# Altium project Motherboard.PrjPcb
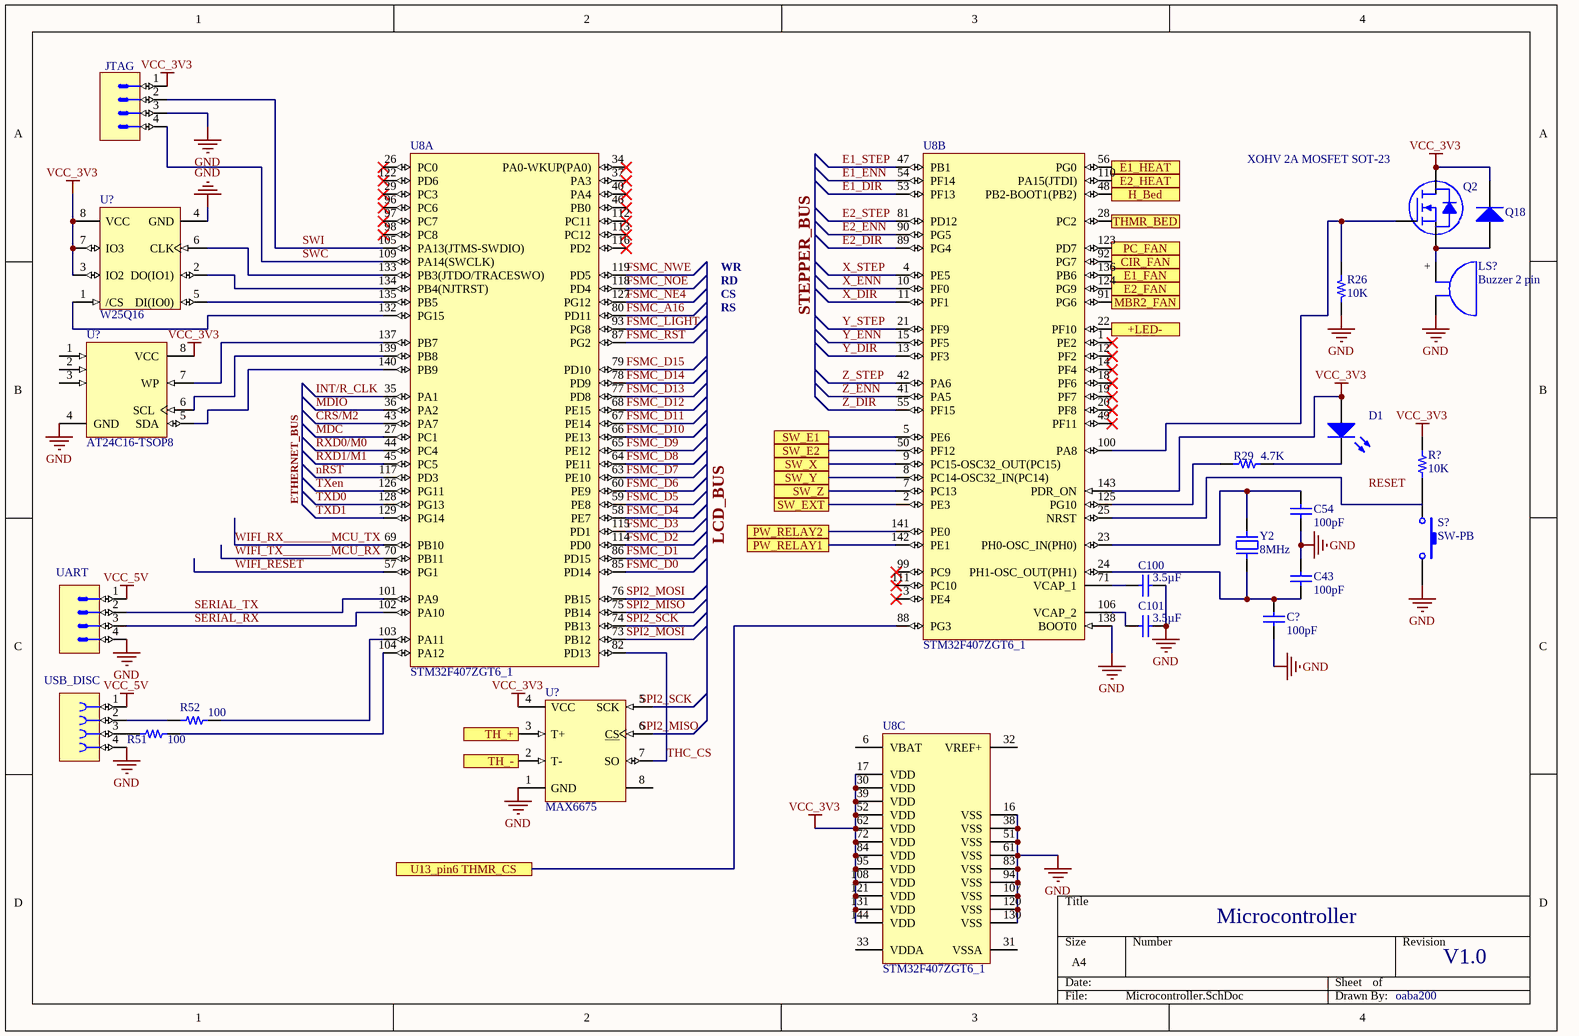
[diagram p0: Microcontroller.SchDoc]
9 sheets, 151 parts. Net scope: flat (ports and power ports of the same name join across sheets).
Sheets:
  Microcontroller.SchDoc
  Stepper drivers.SchDoc
  Heated bed.SchDoc
  LCD Screen.SchDoc
  Limit switches.SchDoc
  Relay controll extension board v1.5.SchDoc
  Extruder.SchDoc
  Ethernet.SchDoc
  Outputs.SchDoc

## Sheet Microcontroller.SchDoc: Microcontroller
size A4; DrawnBy: oaba200; Revision: V1.0

### Parts
(Parts that share a designator on the sheet are numbered #1, #2 ... from top to bottom, then left to right.)
C43  value 100pF  [C1206]  (hidden comment: Cap Semi)
C54  value 100pF  [C1206]  (hidden comment: Cap Semi)
C100  value 3.5µF  [C1206]  (hidden comment: Cap Semi)
C101  value 3.5µF  [C1206]  (hidden comment: Cap Semi)
C?#1  value 100pF  [C1206]  (hidden comment: Cap Semi)
D1  LED3  [3.5X2.8X1.9]  (value not drawn)
JTAG  (no value)
LS?  Buzzer 2 pin
Q2  XOHV 2A MOSFET SOT-23
Q18  Diode 1N4148  [DO-35]  (value not drawn)
R26  10K  [RES 0805_2012]
R29  4.7K  [RES 0805_2012]
R51  100  [RES 0805_2012]
R52  100  [RES 0805_2012]
R?#1  10K  [RES 0805_2012]
S?#1  SW-PB  [SPST-2]
U8  STM32F407ZGT6_1  [STM-LQFP144_N]  (parts A,B,C of 3)
U?#1  W25Q16  [SOIC8]
U?#2  AT24C16-TSOP8  [8A2_N]
U?#3  MAX6675  [SOIC8]
UART  (no value)
USB_DISC  (no value)
Y2  8MHz

### Ports
+LED-, CIR_FAN, E1_FAN, E1_HEAT, E2_FAN, E2_HEAT, H_Bed, MBR2_FAN, PC_FAN, PW_RELAY1, PW_RELAY2, SW_E1, SW_E2, SW_EXT, SW_X, SW_Y, SW_Z, TH_+, TH_-, THMR_BED, U13_pin6 THMR_CS

### Nets
GND: C43.1 C54.2 C100.2 C101.2 C?#1.2 JTAG.3 LS?.- R26.1 S?#1.2 U8.16(VSS) U8.38(VSS) U8.51(VSS) U8.61(VSS) U8.83(VSS) U8.94(VSS) U8.107(VSS) U8.120(VSS) U8.130(VSS) U8.138(BOOT0) U?#1.4(GND) U?#2.4(GND) U?#3.1(GND) UART.4 USB_DISC.4
VCC_3V3: D1.1(A) JTAG.1 Q2.3(D) Q18.2(K) R?#1.2 U8.17(VDD) U8.30(VDD) U8.39(VDD) U8.52(VDD) U8.62(VDD) U8.72(VDD) U8.84(VDD) U8.95(VDD) U8.108(VDD) U8.121(VDD) U8.131(VDD) U8.143(PDR_ON) U8.144(VDD) U?#1.3(IO2) U?#1.7(IO3) U?#1.8(VCC) U?#2.8(VCC) U?#3.4(VCC)
VCC_5V: UART.1 USB_DISC.1
CRS/M2: U8.43(PA7)
E1_DIR: U8.53(PF13)
E1_ENN: U8.54(PF14)
E1_STEP: U8.47(PB1)
E2_DIR: U8.89(PG4)
E2_ENN: U8.90(PG5)
E2_STEP: U8.81(PD12)
FSMC_A16: U8.80(PD11)
FSMC_D0: U8.85(PD14)
FSMC_D1: U8.86(PD15)
FSMC_D2: U8.114(PD0)
FSMC_D3: U8.115(PD1)
FSMC_D4: U8.58(PE7)
FSMC_D5: U8.59(PE8)
FSMC_D6: U8.60(PE9)
FSMC_D7: U8.63(PE10)
FSMC_D8: U8.64(PE11)
FSMC_D9: U8.65(PE12)
FSMC_D10: U8.66(PE13)
FSMC_D11: U8.67(PE14)
FSMC_D12: U8.68(PE15)
FSMC_D13: U8.77(PD8)
FSMC_D14: U8.78(PD9)
FSMC_D15: U8.79(PD10)
FSMC_LIGHT: U8.93(PG8)
FSMC_NE4: U8.127(PG12)
FSMC_NOE: U8.118(PD4)
FSMC_NWE: U8.119(PD5)
FSMC_RST: U8.87(PG2)
INT/R_CLK: U8.35(PA1)
MDC: U8.27(PC1)
MDIO: U8.36(PA2)
nRST: U8.117(PD3)
RXD0/M0: U8.44(PC4)
RXD1/M1: U8.45(PC5)
SERIAL_RX: U8.102(PA10) UART.3
SERIAL_TX: U8.101(PA9) UART.2
SPI2_MISO: U8.75(PB14)
SPI2_MOSI: U8.73(PB12) U8.76(PB15)
SPI2_SCK: U8.74(PB13)
SWC: JTAG.4 U8.109(PA14(SWCLK))
SWI: JTAG.2 U8.105(PA13(JTMS-SWDIO))
THC_CS: U8.82(PD13) U?#3.7(SO)
Thermocouple_+: U?#3.3(T+) ; port TH_+
Thermocouple_-: U?#3.2(T-) ; port TH_-
TXD0: U8.128(PG13)
TXD1: U8.129(PG14)
TXen: U8.126(PG11)
WIFI_RESET: U8.57(PG1)
WIFI_RX________MCU_TX: U8.69(PB10)
WIFI_TX________MCU_RX: U8.70(PB11)
X_DIR: U8.11(PF1)
X_ENN: U8.10(PF0)
X_STEP: U8.4(PE5)
Y_DIR: U8.13(PF3)
Y_ENN: U8.15(PF5)
Y_STEP: U8.21(PF9)
Z_DIR: U8.55(PF15)
Z_ENN: U8.41(PA5)
Z_STEP: U8.42(PA6)
NetC43_2: C43.2 C?#1.1 U8.24(PH1-OSC_OUT(PH1)) Y2.1
NetC54_1: C54.1 U8.23(PH0-OSC_IN(PH0)) Y2.2
NetC100_1: C100.1 U8.71(VCAP_1)
NetC101_1: C101.1 U8.106(VCAP_2)
NetD1_2: D1.2(K) R29.1
NetJP35_1: U8.141(PE0) ; port PW_RELAY2
NetLS?_+: LS?.+ Q2.2(S) Q18.1(A)
NetQ2_1: Q2.1(G) R26.2 U8.100(PA8)
NetQ?_1: U8.110(PA15(JTDI)) ; port E2_HEAT
NetR2_1: U8.5(PE6) ; port SW_E1
NetR3#3_2: U8.22(PF10) ; port +LED-
NetR4_2: U8.50(PF12) ; port SW_E2
NetR6#2_1: U8.9(PC15-OSC32_OUT(PC15)) ; port SW_X
NetR8_2: U8.8(PC14-OSC32_IN(PC14)) ; port SW_Y
NetR10_1: U8.7(PC13) ; port SW_Z
NetR16_1: U8.142(PE1) ; port PW_RELAY1
NetR27_2: U8.91(PG6) ; port MBR2_FAN
NetR29_2: R29.2 U8.125(PG10)
NetR31#2_2: U8.124(PG9) ; port E2_FAN
NetR34_1: U8.136(PB6) ; port E1_FAN
NetR39_1: U8.48(PB2-BOOT1(PB2)) ; port H_Bed
NetR43_1: U8.28(PC2) ; port THMR_BED
NetR48_2: U8.123(PD7) ; port PC_FAN
NetR51_1: R51.1 USB_DISC.3
NetR51_2: R51.2 U8.104(PA12)
NetR52_1: R52.1 USB_DISC.2
NetR52_2: R52.2 U8.103(PA11)
NetR?#1_1: R?#1.1 S?#1.1
NetR?#6_1: U8.2(PE3) ; port SW_EXT
NetU8_56: U8.56(PG0) ; port E1_HEAT
NetU8_88: U8.88(PG3) ; port U13_pin6 THMR_CS
NetU8_92: U8.92(PG7) ; port CIR_FAN
NetU8_132: U8.132(PG15) U?#1.1(/CS)
NetU8_133: U8.133(PB3(JTDO/TRACESWO)) U?#1.6(CLK)
NetU8_134: U8.134(PB4(NJTRST)) U?#1.2(DO(IO1))
NetU8_135: U8.135(PB5) U?#1.5(DI(IO0))
NetU8_137: U8.137(PB7) U?#2.7(WP)
NetU8_139: U8.139(PB8) U?#2.6(SCL)
NetU8_140: U8.140(PB9) U?#2.5(SDA)

Not connected (* = marked no-connect by the designer): U8 1(PE2)* 3(PE4)* 6(VBAT) 12(PF2)* 14(PF4)* 18(PF6)* 19(PF7)* 20(PF8)* 25(NRST) 26(PC0)* 29(PC3)* 31(VSSA) 32(VREF+) 33(VDDA) 34(PA0-WKUP(PA0))* 37(PA3)* 40(PA4)* 46(PB0)* 49(PF11)* 96(PC6)* 97(PC7)* 98(PC8)* 99(PC9)* 111(PC10)* 112(PC11)* 113(PC12)* 116(PD2)* 122(PD6)*; U?#2 1 2 3; U?#3 5(SCK) 6(CS) 8

### Buses and harness runs
bus ETHERNET_BUS
bus LCD_BUS
bus STEPPER_BUS

### Notes on the sheet
- WR
- RD
- CS
- RS
- Labels drawn without touching a wire or pin: RESET, SPI2_MISO, SPI2_SCK

### Library data of the parts
C43 C54 C100 C101 C?#1 = Cap Semi: Capacitor (Semiconductor SIM Model); Published: 8-Jun-2000; LatestRevisionDate: 29-May-2009; LatestRevisionNote: IPC-7351 Footprint Added.; PackageReference: C1206; Publisher: Altium Limited; PackageDescription: Chip Capacitor
D1 = LED3: Typical BLUE SiC LED; Published: 8-Jun-2000; LatestRevisionDate: 17-Dec-2003; LatestRevisionNote: PCB Footprint replaced.; DatasheetVersion: 16-Apr-2002; PackageVersion: 16-Apr-2002; PackageReference: 3.5X2.8X1.9; Publisher: Altium Limited; PackageDescription: SM LED; 2 C-Bend Leads; Body 3.5 x 2.8 x 1.9 mm, inc leads (LxWxH typ)
JTAG UART = Connector 4 Male
Q18 = Diode 1N4148: High Conductance Fast Diode; Published: 8-Jun-2000; LatestRevisionDate: 17-Jul-2002; LatestRevisionNote: Re-released for DXP Platform.; DatasheetVersion: 1997; PackageReference: DO-35; Publisher: Altium Limited; PackageDescription: Diode, Axial; Body 3.8 x 1.9 mm (LxDia. max), Lead Dia. 0.53 mm (max); Code_JEDEC: DO-204-AH; ComponentLink1Description: Manufacturer Link; ComponentLink1URL: http://www.fairchildsemi.com/; ComponentLink2Description: Datasheet; ComponentLink2URL: http://www.fairchildsemi.com/ds/1N%2F1N4148.pdf
R26 R29 R51 R52 R?#1 = Resistor: SMT Resistor
  R26: VALUE: 10K
  R29: VALUE: 4.7K
  R51 R52: VALUE: 100
  R?#1: Value: 10K
S?#1 = SW-PB: Switch; Published: 24-Mar-1999; LatestRevisionDate: 17-Jul-2002; LatestRevisionNote: Re-released for DXP Platform.; PackageReference: SPST-2; Publisher: Altium Limited; PackageDescription: Switch; 2 Leads
U8 = STM32F407ZGT6_1: V2 ARM Cortex-M4 32-bit MCU+FPU, 210 DMIPS, 1024 kB Flash, 192 kB Internal RAM, 114 I/Os, 144-pin LQFP, -40 to 85 degC, Tray; Manufacturer: STMicroelectronics; D/A Converter: 2x12-bit; FLASH Size (Prog) (kB): 1024; I/Os (High Current): 114; Internal RAM Size (kB): 192; Operating Frequency(F) (Processor speed) (MHz): 168; Supply Voltage(Vcc) max (V): 3.6; Supply Voltage(Vcc) min (V): 1.8; DatasheetVersion: Rev. 4; PackageVersion: Rev. 4, 06/2013; PackageReference: LQFP144; PackageDescription: 144-Pin Low Profile Quad Flat Package, 20 x 20 mm Body, 0.5 mm Pitch; Supplier 1: Digi-Key; Supplier Part Number 1: 497-11766-ND; Supplier 2: Newark; Supplier Part Number 2: 73T2334; Supplier 3: Mouser; Supplier Part Number 3: 511-STM32F407ZGT6; Core: ARM Cortex-M4; Packing: Tray; Mounting Technology: Surface Mount; PartNumber: STM32F407ZGT6; ComponentLink1Description: Manufacturer URL; ComponentLink1URL: http://www.st.com/web/en/home.html; ComponentLink2Description: Datasheet; ComponentLink2URL: http://www.st.com/st-web-ui/static/active/en/resource/technical/document/datasheet/DM00037051.pdf; ComponentLink3Description: Package Specification; ComponentLink3URL: http://www.st.com/st-web-ui/static/active/en/resource/technical/document/datasheet/DM00037051.pdf
U?#1 = W25Q16: FLASH - NOR Memory IC 16Mb _2M x 8_ SPI 104MHz 8-SOIC; MP: W25Q16BVSSIG; MF: Winbond; Availability: Unavailable; SnapEDA_Link: https://www.snapeda.com/parts/W25Q16BVSSIG/Winbond%20Electronics/view-part/512685/?ref=snap; Value: *; Price: None; Package: SOIC-8 Winbond
U?#2 = AT24C16-TSOP8: 1Kbit (128 x 8), 2-wire Bus Automotive Serial EEPROM with Write Protect, 2.5V, 8-Pin TSSOP, Bulk; Published: 20-Sep-2010; DatasheetVersion: 8517C,  Jan-2009; PackageVersion: revD, Dec-2009; PackageReference: 8A2; Publisher: Altium Limited; PackageDescription: 8-Lead, 4.4 mm Body, Plastic Thin Shrink Small Outline Package (TSSOP); Code_JEDEC: MO-153-AA; ComponentLink1Description: Manufacturer Link; ComponentLink1URL: http://www.atmel.com/products/serial/default.asp; ComponentLink2Description: Datasheet; ComponentLink2URL: http://www.atmel.com/dyn/resources/prod_documents/doc8517.pdf; ComponentLink3Description: Atmel.com Home; ComponentLink3URL: http://www.atmel.com
USB_DISC = Connector 4 Female
Y2 = Abracon Crystal ABS06: SMT Crystal; VALUE: 8MHz

## Sheet Stepper drivers.SchDoc: Stepper Drivers
size A4; DrawnBy: oaba200
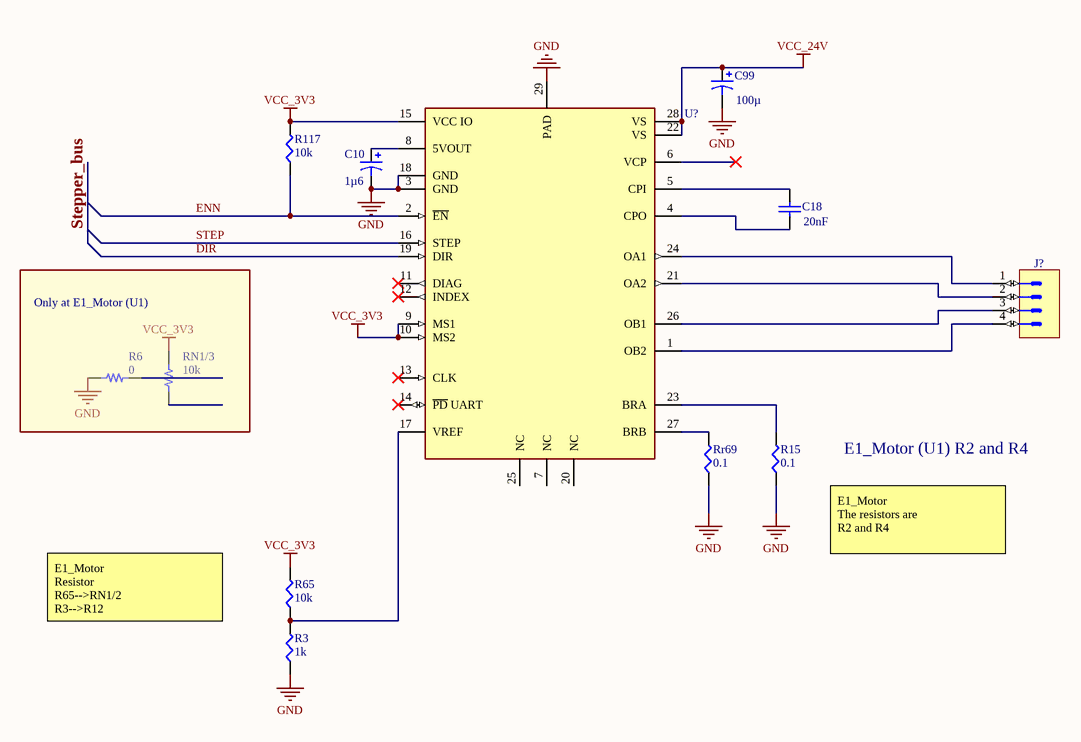
[diagram p1: Stepper drivers.SchDoc]

### Parts
(Parts that share a designator on the sheet are numbered #1, #2 ... from top to bottom, then left to right.)
C10  value 1µ6  [C0805]  (hidden comment: Cap Pol3)
C18  value 20nF  [C1206]  (hidden comment: Cap Semi)
C99  value 100µ  [C0805]  (hidden comment: Cap Pol3)
J?#1  (no value)
R3#1  1k  [SMD-0402-RES]
R6#1  0  [RES 0805_2012]
R15  0.1  [SMD-0402-RES]
R65  10k  [SMD-0402-RES]
R117  10k  [SMD-0402-RES]
RN1/3  10k  [RES 0805_2012]
Rr69  0.1  [SMD-0402-RES]
U?#4  TMC2208-LA  (value not drawn)

### Blocks framed on the sheet
Only at E1_Motor (U1): R6#1 RN1/3

### Nets
GND: C10.2 C99.2 R3#1.1 R6#1.1 R15.1 Rr69.1 U?#4.3(GND) U?#4.18(GND) U?#4.29(PAD)
VCC_3V3: R65.2 R117.2 RN1/3.2 U?#4.9(MS1) U?#4.10(MS2) U?#4.15(VCC_IO)
VCC_24V: C99.1 U?#4.22(VS) U?#4.28(VS)
DIR: U?#4.19(DIR)
ENN: R117.1 U?#4.2(~{EN})
STEP: U?#4.16(STEP)
NetC10_1: C10.1 U?#4.8(5VOUT)
NetC18_1: C18.1 U?#4.5(CPI)
NetC18_2: C18.2 U?#4.4(CPO)
NetJ?#1_1: J?#1.1 U?#4.24(OA1)
NetJ?#1_2: J?#1.2 U?#4.21(OA2)
NetJ?#1_3: J?#1.3 U?#4.26(OB1)
NetJ?#1_4: J?#1.4 U?#4.1(OB2)
NetR3#1_2: R3#1.2 R65.1 U?#4.17(VREF)
NetR15_2: R15.2 U?#4.23(BRA)
NetRr69_2: Rr69.2 U?#4.27(BRB)

Not connected (* = marked no-connect by the designer): R6#1 2; RN1/3 1; U?#4 6(VCP)* 7(NC) 11(DIAG)* 12(INDEX)* 13(CLK)* 14(~{PD}_UART)* 20(NC) 25(NC)

### Buses and harness runs
bus Stepper_bus

### Notes on the sheet
- E1_Motor (U1) R2 and R4
- E1_Motor
  The resistors are
  R2 and R4
- E1_Motor
  Resistor
  R65-->RN1/2
  R3-->R12

### Library data of the parts
C10 C99 = Cap Pol3: Polarized Capacitor (Surface Mount); Published: 8-Jun-2000; LatestRevisionDate: 29-May-2009; LatestRevisionNote: IPC-7351 Footprint Added.; PackageReference: C0805; Publisher: Altium Limited; PackageDescription: Chip Capacitor
C18 = Cap Semi: Capacitor (Semiconductor SIM Model); Published: 8-Jun-2000; LatestRevisionDate: 29-May-2009; LatestRevisionNote: IPC-7351 Footprint Added.; PackageReference: C1206; Publisher: Altium Limited; PackageDescription: Chip Capacitor
J?#1 = Connector 4 Male
R3#1 R65 = ERJ-2GEJ103X: RES SMD 10K OHM 5% 1/10W 0402; Manufacturer: Panasonic Electronic Components; Factory Stock: 0; Unit Price (USD): 0.00350; @ qty: 1500; Minimum Quantity: 1; Power (Watts): 0.1W, 1/10W; Temperature Coefficient: ±200ppm/°C; Part Number: ERJ-2GEJ103X; Datasheets: http://industrial.panasonic.com/www-cgi/jvcr13pz.cgi?E+PZ+3+AOA0001+ERJ2GEJ103X+7+WW; Image: //media.digikey.com/Photos/Panasonic%20Photos/ERJ-PA2-Series.jpg; Digi-Key Part Number: P10KJCT-ND; Quantity Available: 2560215; Packaging: Cut Tape (CT); Series: ERJ; Part Status: Active; Tolerance: ±5%; Composition: Thick Film; Features: Automotive AEC-Q200; Operating Temperature: -55°C ~ 155°C; Package / Case: 0402 (1005 Metric); Supplier Device Package: 0402; Size / Dimension: 0.039" L x 0.020" W (1.00mm x 0.50mm); Height - Seated (Max): 0.016" (0.40mm); Number of Terminations: 2; Failure Rate: -
  R3#1: Value: 1k
  R65: Value: 10k
R6#1 RN1/3 = Resistor: SMT Resistor
  R6#1: VALUE: 0
  RN1/3: VALUE: 10k
R15 Rr69 = ERJ-2BSFR11X: RES SMD 0.11 OHM 1% 1/6W 0402; Manufacturer: Panasonic Electronic Components; Factory Stock: 0; Unit Price (USD): 0.10632; @ qty: 1500; Minimum Quantity: 1; Power (Watts): 0.167W, 1/6W; Temperature Coefficient: ±300ppm/°C; Part Number: ERJ-2BSFR11X; Datasheets: https://industrial.panasonic.com/cdbs/www-data/pdf/RDA0000/AOA0000C239.pdf; Image: //media.digikey.com/Photos/Panasonic%20Photos/ERJ-PA2-Series.jpg; Digi-Key Part Number: P.11AKCT-ND; Quantity Available: 9397; Packaging: Cut Tape (CT); Series: ERJ; Part Status: Active; Value: 0.1; Tolerance: ±1%; Composition: Thick Film; Features: Automotive AEC-Q200, Current Sense; Operating Temperature: -55°C ~ 125°C; Package / Case: 0402 (1005 Metric); Supplier Device Package: 0402; Size / Dimension: 0.039" L x 0.020" W (1.00mm x 0.50mm); Height - Seated (Max): 0.016" (0.40mm); Number of Terminations: 2; Failure Rate: -
R117 = ERJ-2GEJ203X: RES SMD 20K OHM 5% 1/10W 0402; Manufacturer: Panasonic Electronic Components; Factory Stock: 0; Unit Price (USD): 0.00350; @ qty: 1500; Minimum Quantity: 1; Power (Watts): 0.1W, 1/10W; Temperature Coefficient: ±200ppm/°C; Part Number: ERJ-2GEJ203X; Datasheets: http://industrial.panasonic.com/www-cgi/jvcr13pz.cgi?E+PZ+3+AOA0001+ERJ2GEJ203X+7+WW; Image: //media.digikey.com/Photos/Panasonic%20Photos/ERJ-PA2-Series.jpg; Digi-Key Part Number: P20KJCT-ND; Quantity Available: 191642; Packaging: Cut Tape (CT); Series: ERJ; Part Status: Active; Value: 10k; Tolerance: ±5%; Composition: Thick Film; Features: Automotive AEC-Q200; Operating Temperature: -55°C ~ 155°C; Package / Case: 0402 (1005 Metric); Supplier Device Package: 0402; Size / Dimension: 0.039" L x 0.020" W (1.00mm x 0.50mm); Height - Seated (Max): 0.016" (0.40mm); Number of Terminations: 2; Failure Rate: -

## Sheet Heated bed.SchDoc: Heated bed
size A4; DrawnBy: oaba200
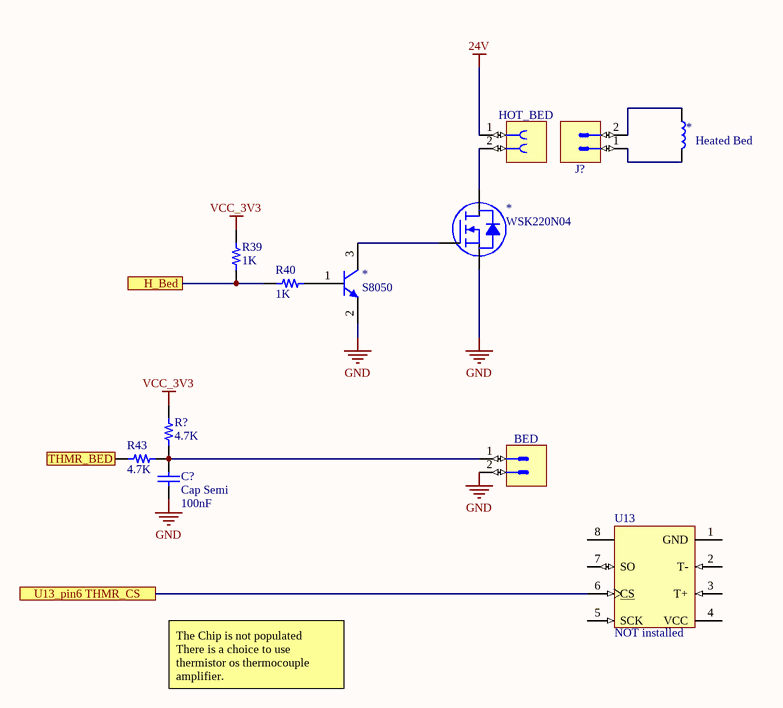
[diagram p2: Heated bed.SchDoc]

### Parts
(Parts that share a designator on the sheet are numbered #1, #2 ... from top to bottom, then left to right.)
*#1  Heated Bed
*#2  WSK220N04  [TO263]
*#3  S8050  [SOT23]
BED  (no value)
C?#2  Cap Semi  value 100nF  [C1206]
HOT_BED  (no value)
J?#2  (no value)
R39  1K
R40  1K
R43  4.7K  [RES 0805_2012]
R?#2  4.7K  [RES 0805_2012]
U13  NOT installed  [SOIC8]

### Ports
H_Bed, THMR_BED, U13_pin6 THMR_CS

### Nets
24V: HOT_BED.1
GND: *#2.2(S) *#3.2(E) BED.2 C?#2.2
VCC_3V3: R39.2 R?#2.1
Net*#1_1: *#1.1 J?#2.2
Net*#1_2: *#1.2 J?#2.1
Net*#2_1: *#2.1(G) *#3.3(C)
Net*#2_3: *#2.3(D) HOT_BED.2
Net*#3_1: *#3.1(B) R40.2
NetBED_1: BED.1 C?#2.1 R43.2 R?#2.2
NetR39_1: R39.1 R40.1 ; port H_Bed
NetR43_1: R43.1 ; port THMR_BED
NetU8_88: U13.6(CS) ; port U13_pin6 THMR_CS

Not connected (* = marked no-connect by the designer): U13 1(GND) 2(T-) 3(T+) 4(VCC) 5(SCK) 7(SO) 8

### Notes on the sheet
- The Chip is not populated
  There is a choice to use thermistor os thermocouple amplifier.
  The output is common with both IC. Only the Chipselest separate.

### Library data of the parts
*#1 = Heater coil
*#2 = WSK220N04: N-Ch MOSFET / 40V  220A
BED J?#2 = Connector 2 Male
C?#2 = Cap Semi: Capacitor (Semiconductor SIM Model); Published: 8-Jun-2000; LatestRevisionDate: 29-May-2009; LatestRevisionNote: IPC-7351 Footprint Added.; PackageReference: C1206; Publisher: Altium Limited; PackageDescription: Chip Capacitor
HOT_BED = Connector 2 Female
R39 R40 R43 R?#2 = Resistor: SMT Resistor
  R43 R?#2: VALUE: 4.7K
U13 = MAX6675

## Sheet LCD Screen.SchDoc: Display Connector
size A4; DrawnBy: oaba200
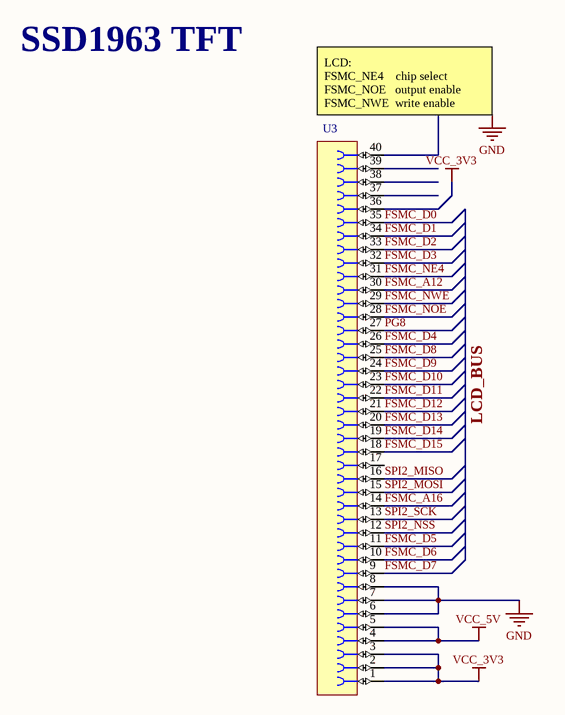
[diagram p3: LCD Screen.SchDoc]

### Parts
U3  (no value)

### Nets
GND: U3.6 U3.7 U3.8 U3.40
VCC_3V3: U3.1 U3.2 U3.3 U3.36
VCC_5V: U3.4 U3.5
FSMC_A12: U3.30
FSMC_A16: U3.14
FSMC_D0: U3.35
FSMC_D1: U3.34
FSMC_D2: U3.33
FSMC_D3: U3.32
FSMC_D4: U3.26
FSMC_D5: U3.11
FSMC_D6: U3.10
FSMC_D7: U3.9
FSMC_D8: U3.25
FSMC_D9: U3.24
FSMC_D10: U3.23
FSMC_D11: U3.22
FSMC_D12: U3.21
FSMC_D13: U3.20
FSMC_D14: U3.19
FSMC_D15: U3.18
FSMC_NE4: U3.31
FSMC_NOE: U3.28
FSMC_NWE: U3.29
PG8: U3.27
SPI2_MISO: U3.16
SPI2_MOSI: U3.15
SPI2_NSS: U3.12
SPI2_SCK: U3.13

Not connected (* = marked no-connect by the designer): U3 17 37 38 39

### Buses and harness runs
bus LCD_BUS

### Notes on the sheet
- SSD1963 TFT
- (near U3) LCD:
  FSMC_NE4    chip select
  FSMC_NOE   output enable
  FSMC_NWE  write enable

### Library data of the parts
U3 = Connector 40 Female

## Sheet Limit switches.SchDoc: Limit switches
size A4; DrawnBy: oaba200
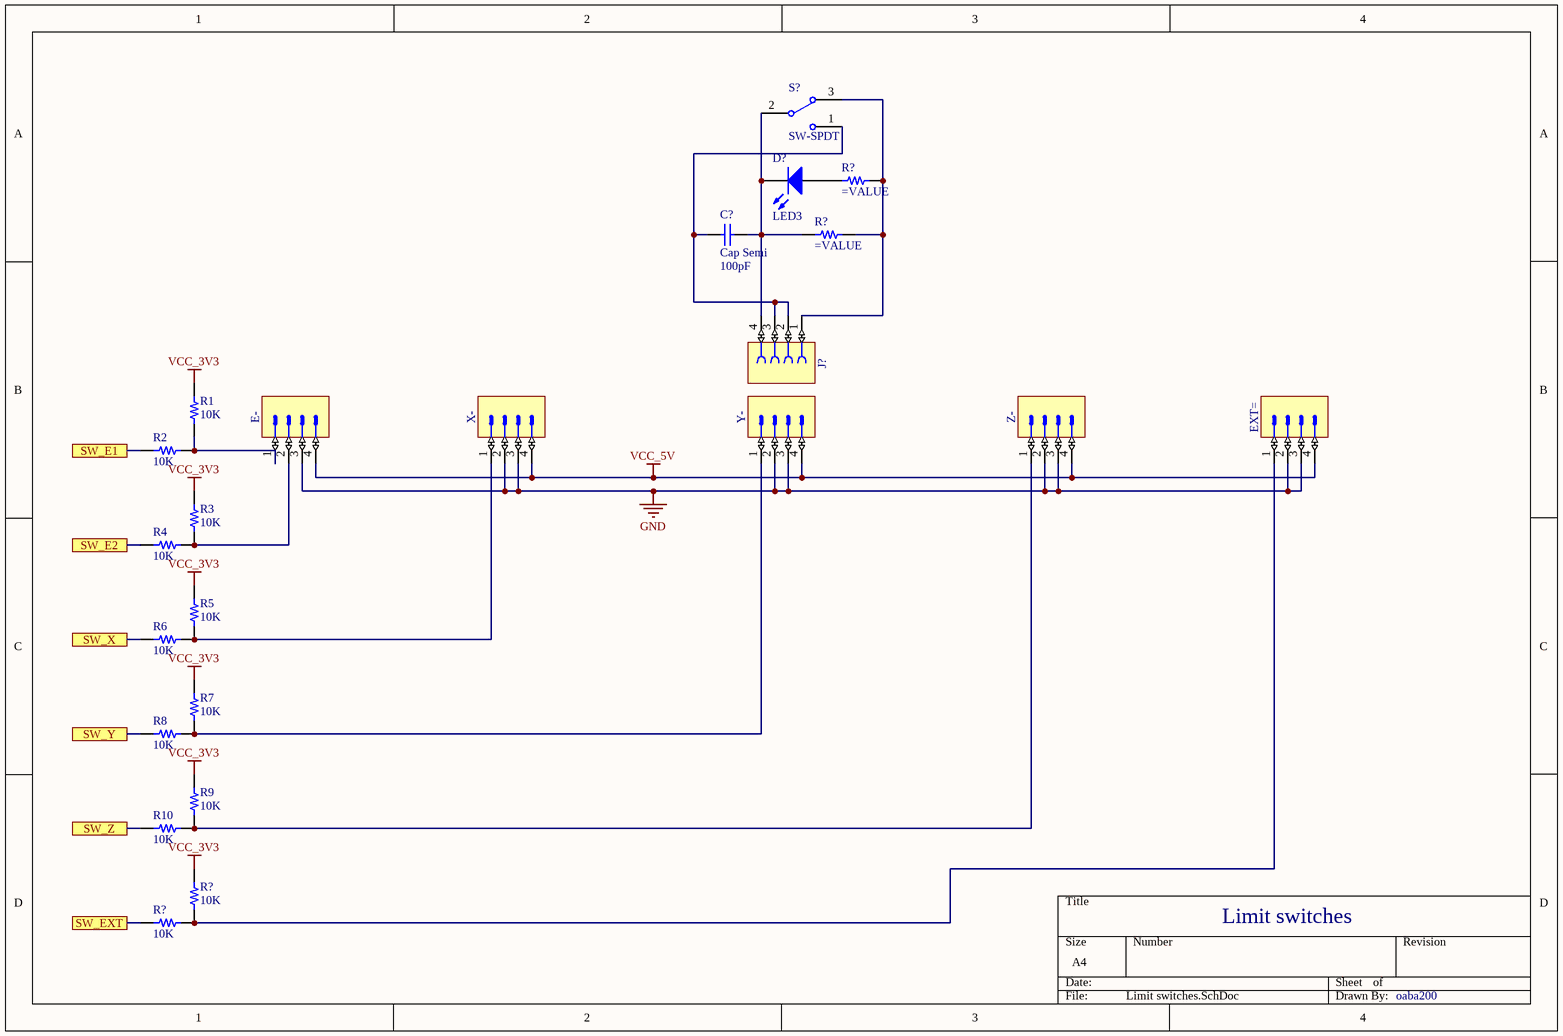
[diagram p4: Limit switches.SchDoc]

### Parts
(Parts that share a designator on the sheet are numbered #1, #2 ... from top to bottom, then left to right.)
C?#3  Cap Semi  value 100pF  [C1206]
D?#1  LED3  [3.5X2.8X1.9]
E-  (no value)
EXT=  (no value)
J?#3  (no value)
R1  10K  [RES 0805_2012]
R2  10K  [RES 0805_2012]
R3#2  10K  [RES 0805_2012]
R4  10K  [RES 0805_2012]
R5#1  10K  [RES 0805_2012]
R6#2  10K  [RES 0805_2012]
R7#1  10K  [RES 0805_2012]
R8  10K  [RES 0805_2012]
R9  10K  [RES 0805_2012]
R10  10K  [RES 0805_2012]
R?#3  (no value)  [RES 0805_2012]
R?#4  (no value)  [RES 0805_2012]
R?#5  10K  [RES 0805_2012]
R?#6  10K  [RES 0805_2012]
S?#2  SW-SPDT  [TL36WW15050]
X-  (no value)
Y-  (no value)
Z-  (no value)

### Ports
SW_E1, SW_E2, SW_EXT, SW_X, SW_Y, SW_Z

### Nets
GND: E-.3 EXT=.2 EXT=.3 X-.2 X-.3 Y-.2 Y-.3 Z-.2 Z-.3
VCC_3V3: R1.1 R3#2.2 R5#1.1 R7#1.2 R9.1 R?#5.1
VCC_5V: E-.4 EXT=.4 X-.4 Y-.4 Z-.4
NetC?#3_1: C?#3.1 J?#3.2 J?#3.3 S?#2.1
NetC?#3_2: C?#3.2 D?#1.2(K) J?#3.4 R?#4.1 S?#2.2
NetD?#1_1: D?#1.1(A) R?#3.1
NetE-_1: E-.1 R1.2 R2.2
NetE-_2: E-.2 R3#2.1 R4.1
NetEXT=_1: EXT=.1 R?#5.2 R?#6.2
NetJ?#3_1: J?#3.1 R?#3.2 R?#4.2 S?#2.3
NetR2_1: R2.1 ; port SW_E1
NetR4_2: R4.2 ; port SW_E2
NetR5#1_2: R5#1.2 R6#2.2 X-.1
NetR6#2_1: R6#2.1 ; port SW_X
NetR7#1_1: R7#1.1 R8.1 Y-.1
NetR8_2: R8.2 ; port SW_Y
NetR9_2: R9.2 R10.2 Z-.1
NetR10_1: R10.1 ; port SW_Z
NetR?#6_1: R?#6.1 ; port SW_EXT

### Library data of the parts
C?#3 = Cap Semi: Capacitor (Semiconductor SIM Model); Published: 8-Jun-2000; LatestRevisionDate: 29-May-2009; LatestRevisionNote: IPC-7351 Footprint Added.; PackageReference: C1206; Publisher: Altium Limited; PackageDescription: Chip Capacitor
D?#1 = LED3: Typical BLUE SiC LED; Published: 8-Jun-2000; LatestRevisionDate: 17-Dec-2003; LatestRevisionNote: PCB Footprint replaced.; DatasheetVersion: 16-Apr-2002; PackageVersion: 16-Apr-2002; PackageReference: 3.5X2.8X1.9; Publisher: Altium Limited; PackageDescription: SM LED; 2 C-Bend Leads; Body 3.5 x 2.8 x 1.9 mm, inc leads (LxWxH typ)
E- EXT= X- Y- Z- = Connector 4 Male
J?#3 = Connector 4 Female
R1 R2 R3#2 R4 R5#1 R6#2 R7#1 R8-R10 R?#3-R?#6 = Resistor: SMT Resistor
  R1 R2 R3#2 R4 R5#1 R6#2 R7#1 R8-R10 R?#5 R?#6: VALUE: 10K
S?#2 = SW-SPDT: SPDT Subminiature Toggle Switch, Right Angle Mounting, Vertical Actuation; Published: 24-Mar-1999; LatestRevisionDate: 17-Dec-2003; LatestRevisionNote: Schematic revised, PCB Footprint replaced.; DatasheetVersion: 05-Dec-2000; PackageReference: TL36WW15050; Publisher: Altium Limited; PackageDescription: Switch; 4 Leads; ComponentLink1Description: Manufacturer Link; ComponentLink1URL: http://www.apem.com

## Sheet Relay controll extension board v1.5.SchDoc: Power Relay board
size A4; DrawnBy: oaba200; Revision: CBD200509-11 V1.5
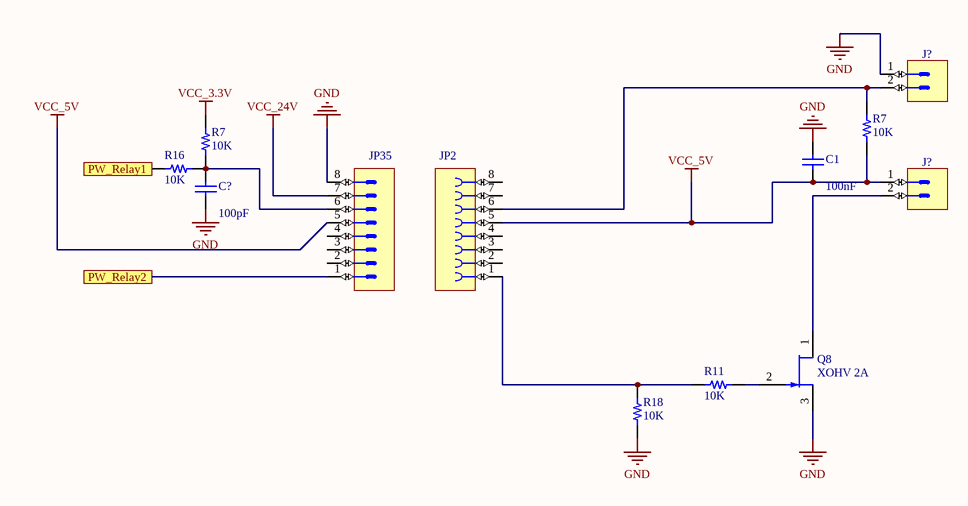
[diagram p5: Relay controll extension board v1.5.SchDoc]

### Parts
(Parts that share a designator on the sheet are numbered #1, #2 ... from top to bottom, then left to right.)
C1  value 100nF  [C1206]  (hidden comment: Cap Semi)
C?#4  value 100pF  [C1206]  (hidden comment: Cap Semi)
J?#4  (no value)
J?#5  (no value)
JP2  (no value)
JP35  (no value)
Q8  XOHV 2A  [TO-254-AA]
R7#2  10K  [RES 0805_2012]
R7#3  10K  [RES 0805_2012]
R11  10K  [RES 0805_2012]
R16  10K  [RES 0805_2012]
R18  10K  [RES 0805_2012]

### Ports
PW_Relay1, PW_Relay2

### Nets
GND: C1.2 C?#4.1 J?#4.1 JP35.8 Q8.3(S) R18.2
VCC_3.3V: R7#3.1
VCC_5V: C1.1 J?#5.1 JP2.5 JP35.5 R7#2.1
VCC_24V: JP35.7
NetC?#4_2: C?#4.2 JP35.6 R7#3.2 R16.2
NetJ?#4_2: J?#4.2 JP2.6 R7#2.2
NetJ?#5_2: J?#5.2 Q8.1(D)
NetJP2_1: JP2.1 R11.1 R18.1
NetJP35_1: JP35.1 ; port PW_Relay2
NetQ8_2: Q8.2(G) R11.2
NetR16_1: R16.1 ; port PW_Relay1

Not connected (* = marked no-connect by the designer): JP2 2 3 4 7 8; JP35 2 3 4

### Library data of the parts
C1 C?#4 = Cap Semi: Capacitor (Semiconductor SIM Model); Published: 8-Jun-2000; LatestRevisionDate: 29-May-2009; LatestRevisionNote: IPC-7351 Footprint Added.; PackageReference: C1206; Publisher: Altium Limited; PackageDescription: Chip Capacitor
J?#4 J?#5 = Connector 2 Male
JP2 = Connector 8 Female
JP35 = Connector 8 Male
Q8 = JFET-N: N-Channel JFET; Published: 8-Jun-2000; LatestRevisionDate: 17-Jul-2002; LatestRevisionNote: Re-released for DXP Platform.; PackageReference: TO-254-AA; Publisher: Altium Limited; Code_JEDEC: TO-254-AA
R7#2 R7#3 R11 R16 R18 = Resistor: SMT Resistor
  R7#2 R7#3 R11 R18: VALUE: 10K
  R16: value: 10K

## Sheet Extruder.SchDoc: Extruder
size A4; DrawnBy: oaba200
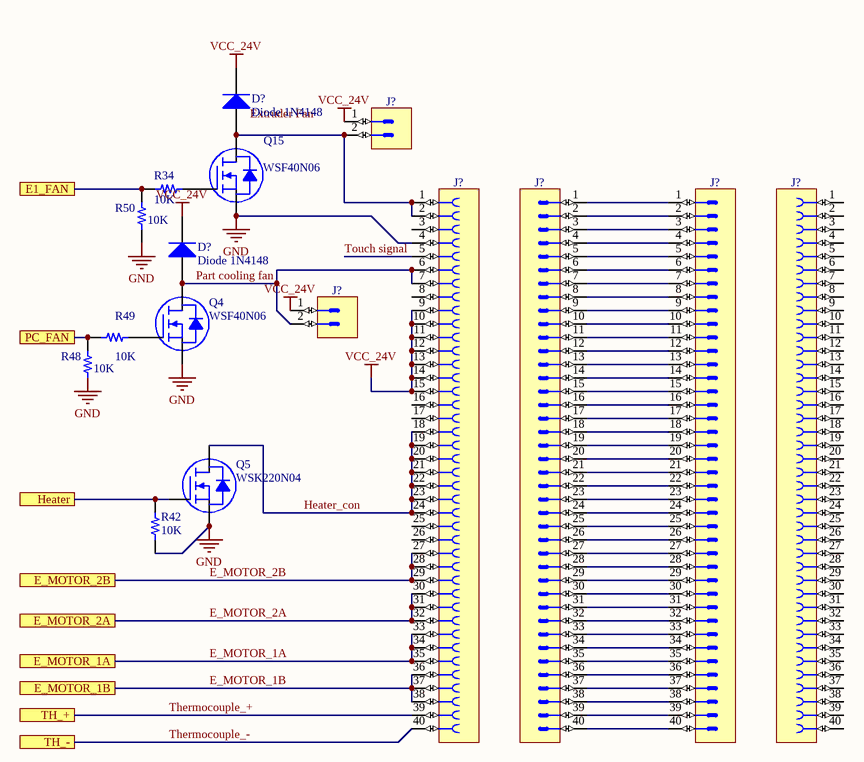
[diagram p6: Extruder.SchDoc]

### Parts
(Parts that share a designator on the sheet are numbered #1, #2 ... from top to bottom, then left to right.)
D?#2  Diode 1N4148  [DO-35]
D?#3  Diode 1N4148  [DO-35]
J?#6  (no value)
J?#7  (no value)
J?#8  (no value)
J?#9  (no value)
J?#10  (no value)
J?#11  (no value)
Q4  WSF40N06  [TO263]
Q5  WSK220N04  [TO263]
Q15  WSF40N06  [TO263]
R34  10K  [RES 0805_2012]
R42  10K  [RES 0805_2012]
R48  10K  [RES 0805_2012]
R49  10K  [RES 0805_2012]
R50  10K  [RES 0805_2012]

### Ports
E1_FAN, E_MOTOR_1A, E_MOTOR_1B, E_MOTOR_2A, E_MOTOR_2B, Heater, PC_FAN, TH_+, TH_-

### Nets
GND: J?#7.4 Q4.2(S) Q5.2(S) Q15.2(S) R42.1 R50.1
VCC_24V: D?#2.2(K) D?#3.2(K) J?#6.1 J?#7.9 J?#7.10 J?#7.11 J?#7.12 J?#7.13 J?#7.14 J?#7.15 J?#11.1
E_MOTOR_1A: J?#7.33 J?#7.34 J?#7.35 ; port E_MOTOR_1A
E_MOTOR_1B: J?#7.36 J?#7.37 J?#7.38 ; port E_MOTOR_1B
E_MOTOR_2A: J?#7.30 J?#7.31 J?#7.32 ; port E_MOTOR_2A
E_MOTOR_2B: J?#7.27 J?#7.28 J?#7.29 ; port E_MOTOR_2B
Heater_con: J?#7.18 J?#7.19 J?#7.20 J?#7.21 J?#7.22 J?#7.23 J?#7.24 Q5.3(D)
Part cooling fan: D?#3.1(A) J?#7.6 J?#7.7 J?#11.2 Q4.3(D)
Thermocouple_+: J?#7.39 ; port TH_+
Thermocouple_-: J?#7.40 ; port TH_-
Touch signal: J?#7.5
NetD?#2_1: D?#2.1(A) J?#6.2 J?#7.1 J?#7.2 Q15.3(D)
NetJ?#8_1: J?#8.1 J?#9.1
NetJ?#8_2: J?#8.2 J?#9.2
NetJ?#8_3: J?#8.3 J?#9.3
NetJ?#8_4: J?#8.4 J?#9.4
NetJ?#8_5: J?#8.5 J?#9.5
NetJ?#8_6: J?#8.6 J?#9.6
NetJ?#8_7: J?#8.7 J?#9.7
NetJ?#8_8: J?#8.8 J?#9.8
NetJ?#8_9: J?#8.9 J?#9.9
NetJ?#8_10: J?#8.10 J?#9.10
NetJ?#8_11: J?#8.11 J?#9.11
NetJ?#8_12: J?#8.12 J?#9.12
NetJ?#8_13: J?#8.13 J?#9.13
NetJ?#8_14: J?#8.14 J?#9.14
NetJ?#8_15: J?#8.15 J?#9.15
NetJ?#8_16: J?#8.16 J?#9.16
NetJ?#8_17: J?#8.17 J?#9.17
NetJ?#8_18: J?#8.18 J?#9.18
NetJ?#8_19: J?#8.19 J?#9.19
NetJ?#8_20: J?#8.20 J?#9.20
NetJ?#8_21: J?#8.21 J?#9.21
NetJ?#8_22: J?#8.22 J?#9.22
NetJ?#8_23: J?#8.23 J?#9.23
NetJ?#8_24: J?#8.24 J?#9.24
NetJ?#8_25: J?#8.25 J?#9.25
NetJ?#8_26: J?#8.26 J?#9.26
NetJ?#8_27: J?#8.27 J?#9.27
NetJ?#8_28: J?#8.28 J?#9.28
NetJ?#8_29: J?#8.29 J?#9.29
NetJ?#8_30: J?#8.30 J?#9.30
NetJ?#8_31: J?#8.31 J?#9.31
NetJ?#8_32: J?#8.32 J?#9.32
NetJ?#8_33: J?#8.33 J?#9.33
NetJ?#8_34: J?#8.34 J?#9.34
NetJ?#8_35: J?#8.35 J?#9.35
NetJ?#8_36: J?#8.36 J?#9.36
NetJ?#8_37: J?#8.37 J?#9.37
NetJ?#8_38: J?#8.38 J?#9.38
NetJ?#8_39: J?#8.39 J?#9.39
NetJ?#8_40: J?#8.40 J?#9.40
NetQ4_1: Q4.1(G) R49.2
NetQ5_1: Q5.1(G) R42.2 ; port Heater
NetQ15_1: Q15.1(G) R34.2
NetR34_1: R34.1 R50.2 ; port E1_FAN
NetR48_2: R48.2 R49.1 ; port PC_FAN

Not connected (* = marked no-connect by the designer): J?#7 3 8 16 17 25 26; J?#10 1 2 3 4 5 6 7 8 9 10 11 12 13 14 15 16 17 18 19 20 21 22 23 24 25 26 27 28 29 30 31 32 33 34 35 36 37 38 39 40; R48 1

### Notes on the sheet
- Labels drawn without touching a wire or pin: Extruder Fan, GND

### Library data of the parts
D?#2 D?#3 = Diode 1N4148: High Conductance Fast Diode; Published: 8-Jun-2000; LatestRevisionDate: 17-Jul-2002; LatestRevisionNote: Re-released for DXP Platform.; DatasheetVersion: 1997; PackageReference: DO-35; Publisher: Altium Limited; PackageDescription: Diode, Axial; Body 3.8 x 1.9 mm (LxDia. max), Lead Dia. 0.53 mm (max); Code_JEDEC: DO-204-AH; ComponentLink1Description: Manufacturer Link; ComponentLink1URL: http://www.fairchildsemi.com/; ComponentLink2Description: Datasheet; ComponentLink2URL: http://www.fairchildsemi.com/ds/1N%2F1N4148.pdf
J?#6 J?#11 = Connector 2 Male
J?#7 J?#10 = Connector 40 Female
J?#8 J?#9 = Connector 40 Male
Q4 Q5 Q15 = WSK220N04: N-Ch MOSFET / 40V  220A
R34 R42 R48-R50 = Resistor: SMT Resistor; VALUE: 10K

## Sheet Ethernet.SchDoc: Ethernet controller
size A4; DrawnBy: oaba200
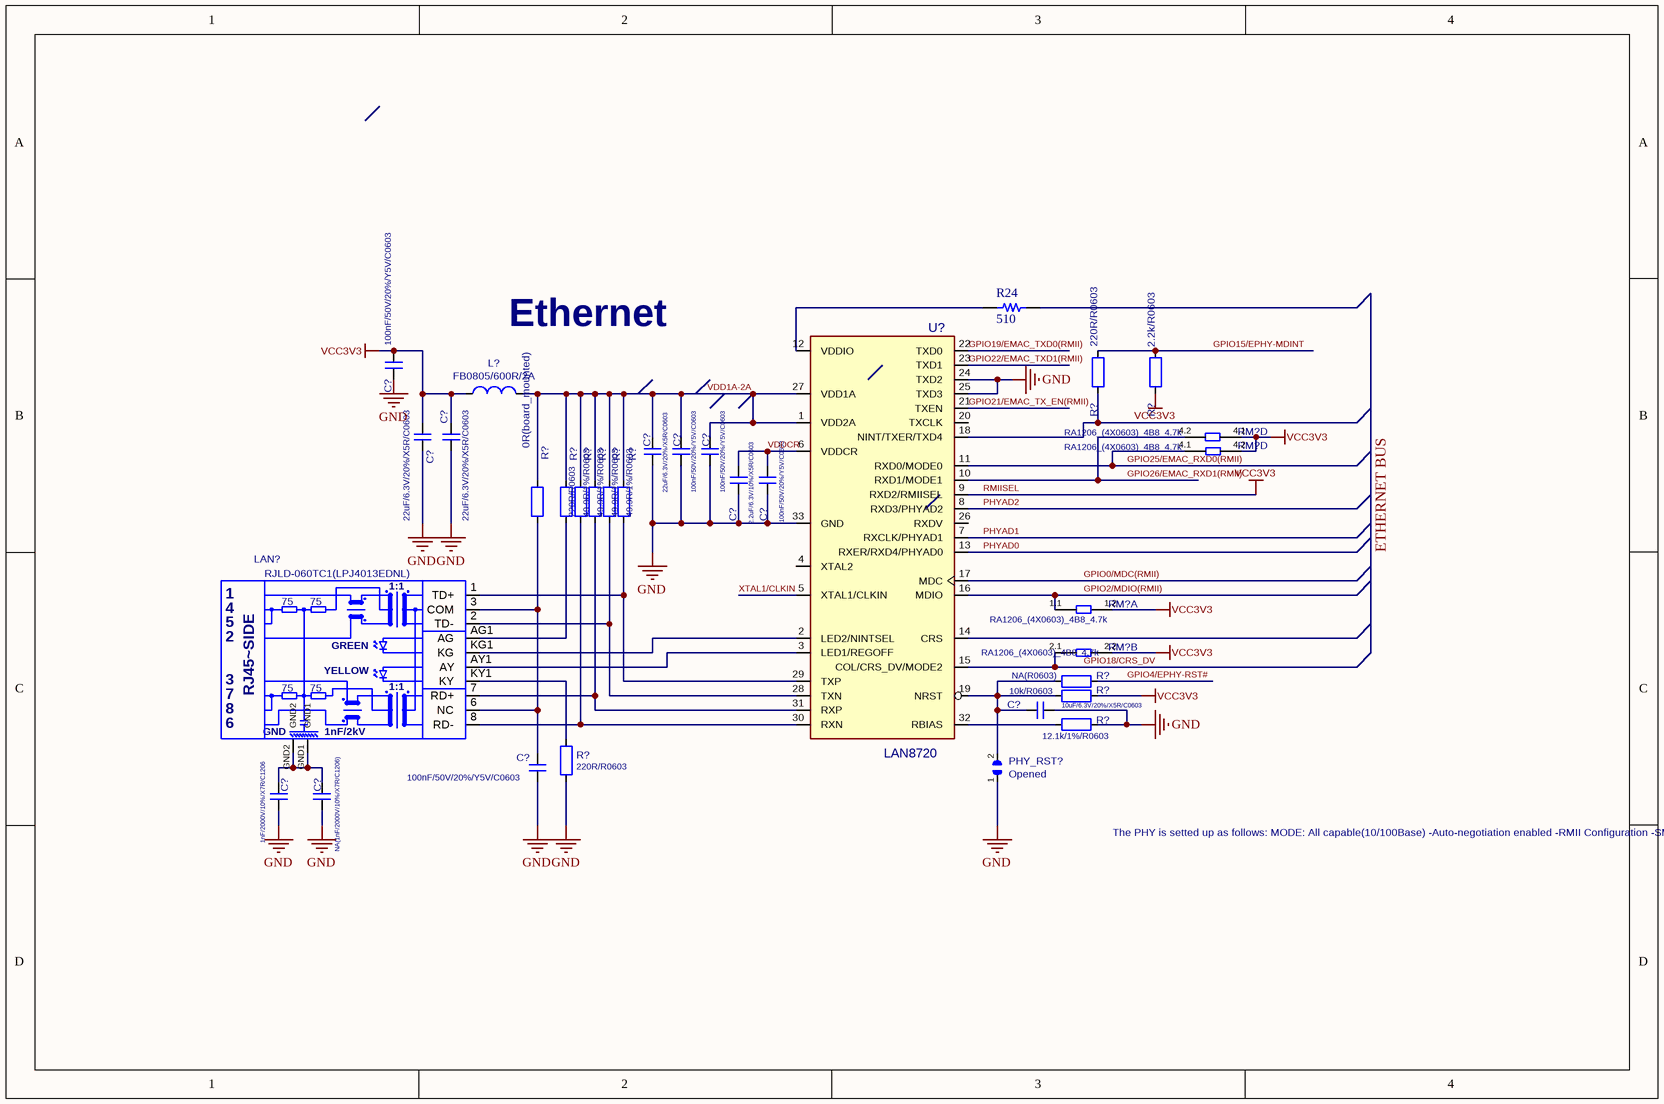
[diagram p7: Ethernet.SchDoc]

### Parts
(Parts that share a designator on the sheet are numbered #1, #2 ... from top to bottom, then left to right.)
C?#5  100nF/50V/20%/Y5V/C0603  [C_0603_5MIL_DWS]
C?#6  22uF/6.3V/20%/X5R/C0603  [C_0603_5MIL_DWS]
C?#7  22uF/6.3V/20%/X5R/C0603  [C_0603_5MIL_DWS]
C?#8  22uF/6.3V/20%/X5R/C0603  [C_0603_5MIL_DWS]
C?#9  100nF/50V/20%/Y5V/C0603  [C_0603_5MIL_DWS]
C?#10  100nF/50V/20%/Y5V/C0603  [C_0603_5MIL_DWS]
C?#11  2.2uF/6.3V/10%/X5R/C0603  [C_0603_5MIL_DWS]
C?#12  100nF/50V/20%/Y5V/C0603  [C_0603_5MIL_DWS]
C?#13  10uF/6.3V/20%/X5R/C0603  [C_0603_5MIL_DWS]
C?#14  100nF/50V/20%/Y5V/C0603  [C_0603_5MIL_DWS]
C?#15  1nF/2000V/10%/X7R/C1206  [C_1206_5MIL_DWS_ISO]
C?#16  NA(1nF/2000V/10%/X7R/C1206)  [C_1206_5MIL_DWS_ISO]
L?  FB0805/600R/2A  [L_0805_5MIL_DWS]
LAN?  RJLD-060TC1(LPJ4013EDNL)  [RJLBC-060TC1]
PHY_RST?  Opened  [SJ]
R24  510  [RES 0805_2012]
R?#7  220R/R0603  [R_0603_5MIL_DWS]
R?#8  2.2k/R0603  [R_0603_5MIL_DWS]
R?#9  0R(board_mounted)  [0R_0603]
R?#10  220R/R0603  [R_0603_5MIL_DWS]
R?#11  49.9R/1%/R0603  [R_0603_5MIL_DWS]
R?#12  49.9R/1%/R0603  [R_0603_5MIL_DWS]
R?#13  49.9R/1%/R0603  [R_0603_5MIL_DWS]
R?#14  49.9R/1%/R0603  [R_0603_5MIL_DWS]
R?#15  NA(R0603)  [R_0603_5MIL_DWS]
R?#16  10k/R0603  [R_0603_5MIL_DWS]
R?#17  12.1k/1%/R0603  [R_0603_5MIL_DWS]
R?#18  220R/R0603  [R_0603_5MIL_DWS]
RM?#1  RA1206_(4X0603)_4B8_4.7k  [R_MATRIX_4]  (part D of 4)
RM?#2  RA1206_(4X0603)_4B8_4.7k  [R_MATRIX_4]  (part D of 4)
RM?#3  RA1206_(4X0603)_4B8_4.7k  [R_MATRIX_4]  (part A of 4)
RM?#4  RA1206_(4X0603)_4B8_4.7k  [R_MATRIX_4]  (part B of 4)
U?#5  LAN8720  [QFN32_EP(33)_5.00x5.00x0.90mm_Pitch_0.50mm]

### Nets
GND: C?#5.2 C?#6.2 C?#7.2 C?#8.2 C?#9.2 C?#10.2 C?#11.2 C?#12.2 C?#13.1 C?#14.2 C?#15.2 C?#16.2 PHY_RST?.1 R?#17.2 R?#18.2 U?#5.24(TXD2) U?#5.25(TXD3) U?#5.33(GND)
RMIISEL: C?#5.1 C?#6.1 C?#7.1 L?.1 R?#8.1 R?#16.2 RM?#1.4.1 RM?#2.4.2 RM?#3.1.2 RM?#4.2.2 U?#5.9(RXD2/RMIISEL)  [also labelled VCC3V3]
GPIO0/MDC(RMII): U?#5.17(MDC)
GPIO2/MDIO(RMII): RM?#3.1.1 U?#5.16(MDIO)
GPIO4/EPHY-RST#: R?#15.2
GPIO15/EPHY-MDINT: R?#7.2 R?#8.2
GPIO18/CRS_DV: RM?#4.2.1 U?#5.15(COL/CRS_DV/MODE2)
GPIO19/EMAC_TXD0(RMII): U?#5.22(TXD0)
GPIO21/EMAC_TX_EN(RMII): U?#5.21(TXEN)
GPIO22/EMAC_TXD1(RMII): U?#5.23(TXD1)
GPIO25/EMAC_RXD0(RMII): RM?#2.4.1 U?#5.11(RXD0/MODE0)
GPIO26/EMAC_RXD1(RMII): RM?#1.4.2 U?#5.10(RXD1/MODE1)
PHYAD0: U?#5.13(RXER/RXD4/PHYAD0)
PHYAD1: U?#5.7(RXCLK/PHYAD1)
PHYAD2: U?#5.8(RXD3/PHYAD2)
VDD1A-2A: C?#8.1 C?#9.1 C?#10.1 L?.2 R?#9.1 R?#10.1 R?#11.1 R?#12.1 R?#13.1 R?#14.1 U?#5.1(VDD2A) U?#5.27(VDD1A)
VDDCR: C?#11.1 C?#12.1 U?#5.6(VDDCR)
XTAL1/CLKIN: U?#5.5(XTAL1/CLKIN)
NetC?#13_2: C?#13.2 PHY_RST?.2 R?#15.1 R?#16.1 U?#5.19(NRST)
NetC?#14_1: C?#14.1 LAN?.3(COM) LAN?.6(NC) R?#9.2
NetC?#15_1: C?#15.1 C?#16.1 LAN?.GND1 LAN?.GND2
NetLAN?_1: LAN?.1(TD+) R?#14.2 U?#5.29(TXP)
NetLAN?_2: LAN?.2(TD-) R?#13.2 U?#5.28(TXN)
NetLAN?_7: LAN?.7(RD+) R?#12.2 U?#5.31(RXP)
NetLAN?_8: LAN?.8(RD-) R?#11.2 U?#5.30(RXN)
NetLAN?_AG1: LAN?.AG1(AG) R?#10.2
NetLAN?_AY1: LAN?.AY1(AY) U?#5.3(LED1/REGOFF)
NetLAN?_KG1: LAN?.KG1(KG) U?#5.2(LED2/NINTSEL)
NetLAN?_KY1: LAN?.KY1(KY) R?#18.1
NetR24_1: R24.1 U?#5.12(VDDIO)
NetR?#7_1: R?#7.1 U?#5.18(NINT/TXER/TXD4)
NetR?#17_1: R?#17.1 U?#5.32(RBIAS)

Not connected (* = marked no-connect by the designer): R24 2; U?#5 4(XTAL2) 14(CRS) 20(TXCLK) 26(RXDV)

### Buses and harness runs
bus ETHERNET BUS

### Notes on the sheet
- Ethernet
- (near U?#5) In RMII
  Mode
- The PHY is setted up as follows:
  MODE: All capable(10/100Base)
  -Auto-negotiation enabled
  -RMII Configuration
  -SMI address: 0x00
- (in symbol RJLBC-060TC1_GND) 1:1; 75; 4; 5; GREEN; RJ45~SIDE; YELLOW; GND; 1nF/2kV

### Library data of the parts
C?#5-C?#16 = C: Fieldname 1: Value 1; Fieldname2: Value2; Fieldname3: Value3
  C?#5 C?#9 C?#10 C?#12 C?#14: Value: 100nF/50V/20%/Y5V/C0603; Footprint: OLIMEX_RLC-FP:C_0603_5MIL_DWS
  C?#6-C?#8: Value: 22uF/6.3V/20%/X5R/C0603; Footprint: OLIMEX_RLC-FP:C_0603_5MIL_DWS
  C?#11: Value: 2.2uF/6.3V/10%/X5R/C0603; Footprint: OLIMEX_RLC-FP:C_0603_5MIL_DWS
  C?#13: Value: 10uF/6.3V/20%/X5R/C0603; Footprint: OLIMEX_RLC-FP:C_0603_5MIL_DWS
  C?#15: Value: 1nF/2000V/10%/X7R/C1206; Footprint: OLIMEX_RLC-FP:C_1206_5MIL_DWS_ISO
  C?#16: Value: NA(1nF/2000V/10%/X7R/C1206); Footprint: OLIMEX_RLC-FP:C_1206_5MIL_DWS_ISO
L? = L: Fieldname 1: Value 1; Fieldname2: Value2; Fieldname3: Value3; Value: FB0805/600R/2A; Footprint: OLIMEX_RLC-FP:L_0805_5MIL_DWS
LAN? = RJLBC-060TC1_GND: Fieldname 1: Value 1; Fieldname2: Value2; Fieldname3: Value3; Value: RJLD-060TC1(LPJ4013EDNL); Footprint: OLIMEX_Connectors-FP:RJLBC-060TC1
PHY_RST? = SJ: Fieldname 1: Value 1; Fieldname2: Value2; Fieldname3: Value3; Value: Opened; Footprint: OLIMEX_Jumpers-FP:SJ
R24 = Resistor: SMT Resistor; VALUE: 510
R?#7-R?#18 = R: Fieldname 1: Value 1; Fieldname2: Value2; Fieldname3: Value3
  R?#7 R?#10 R?#18: Value: 220R/R0603; Footprint: OLIMEX_RLC-FP:R_0603_5MIL_DWS
  R?#8: Value: 2.2k/R0603; Footprint: OLIMEX_RLC-FP:R_0603_5MIL_DWS
  R?#9: Value: 0R(board_mounted); Footprint: OLIMEX_RLC-FP:0R_0603
  R?#11-R?#14: Value: 49.9R/1%/R0603; Footprint: OLIMEX_RLC-FP:R_0603_5MIL_DWS
  R?#15: Value: NA(R0603); Footprint: OLIMEX_RLC-FP:R_0603_5MIL_DWS
  R?#16: Value: 10k/R0603; Footprint: OLIMEX_RLC-FP:R_0603_5MIL_DWS
  R?#17: Value: 12.1k/1%/R0603; Footprint: OLIMEX_RLC-FP:R_0603_5MIL_DWS
RM?#1 RM?#3 RM?#4 = RA1206_(4x0603)_4B8_Smashed: Value: RA1206_(4X0603)_4B8_4.7k; Footprint: OLIMEX_RLC-FP:R_MATRIX_4
RM?#2 = RA1206_(4x0603)_4B8_Smashed: Fieldname 1: Value 1; Fieldname2: Value2; Fieldname3: Value3; Value: RA1206_(4X0603)_4B8_4.7k; Footprint: OLIMEX_RLC-FP:R_MATRIX_4
U?#5 = LAN8720: Fieldname 1: Value 1; Fieldname2: Value2; Fieldname3: Value3; Footprint: OLIMEX_IC-FP:QFN32_EP(33)_5.00x5.00x0.90mm_Pitch_0.50mm; Value: LAN8720

## Sheet Outputs.SchDoc: Controlled Outputs
size A4; DrawnBy: oaba200
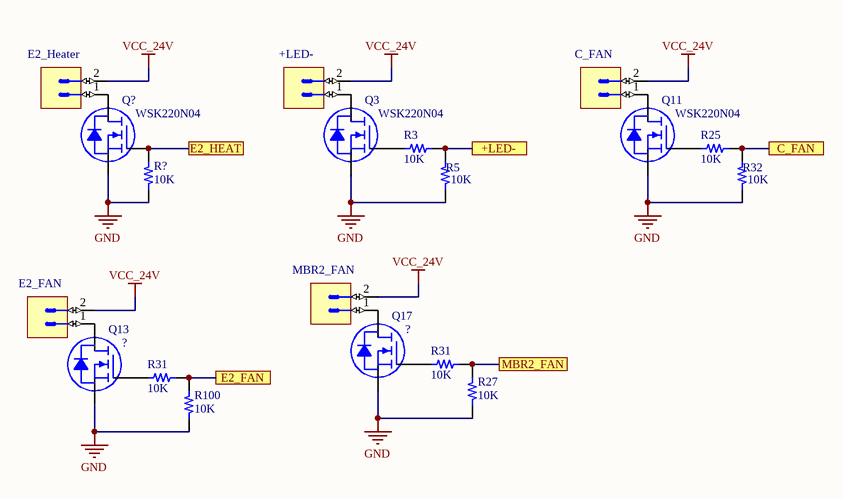
[diagram p8: Outputs.SchDoc]

### Parts
(Parts that share a designator on the sheet are numbered #1, #2 ... from top to bottom, then left to right.)
+LED-  (no value)
C_FAN  (no value)
E2_FAN  (no value)
E2_Heater  (no value)
MBR2_FAN  (no value)
Q3  WSK220N04  [TO263]
Q11  WSK220N04  [TO263]
Q13  ?  [TO263]
Q17  ?  [TO263]
Q?  WSK220N04  [TO263]
R3#3  10K  [RES 0805_2012]
R5#2  10K  [RES 0805_2012]
R25  10K  [RES 0805_2012]
R27  10K  [RES 0805_2012]
R31#1  10K  [RES 0805_2012]
R31#2  10K  [RES 0805_2012]
R32  10K  [RES 0805_2012]
R100  10K  [RES 0805_2012]
R?#19  10K  [RES 0805_2012]

### Ports
+LED-, C_FAN, E2_FAN, E2_HEAT, MBR2_FAN

### Nets
GND: Q3.2(S) Q11.2(S) Q13.2(S) Q17.2(S) Q?.2(S) R5#2.1 R27.1 R32.1 R100.1 R?#19.1
VCC_24V: +LED-.2 C_FAN.2 E2_FAN.2 E2_Heater.2 MBR2_FAN.2
Net+LED-_1: +LED-.1 Q3.3(D)
NetC_FAN_1: C_FAN.1 Q11.3(D)
NetE2_FAN_1: E2_FAN.1 Q13.3(D)
NetE2_Heater_1: E2_Heater.1 Q?.3(D)
NetMBR2_FAN_1: MBR2_FAN.1 Q17.3(D)
NetQ3_1: Q3.1(G) R3#3.1
NetQ11_1: Q11.1(G) R25.1
NetQ13_1: Q13.1(G) R31#2.1
NetQ17_1: Q17.1(G) R31#1.1
NetQ?_1: Q?.1(G) R?#19.2 ; port E2_HEAT
NetR3#3_2: R3#3.2 R5#2.2 ; port +LED-
NetR25_2: R25.2 R32.2 ; port C_FAN
NetR27_2: R27.2 R31#1.2 ; port MBR2_FAN
NetR31#2_2: R31#2.2 R100.2 ; port E2_FAN

### Library data of the parts
+LED- C_FAN E2_FAN E2_Heater MBR2_FAN = Connector 2 Male
Q3 Q11 Q13 Q17 Q? = WSK220N04: N-Ch MOSFET / 40V  220A
R3#3 R5#2 R25 R27 R31#1 R31#2 R32 R100 R?#19 = Resistor: SMT Resistor; VALUE: 10K
  R5#2 R27 R32 R100: Parameter 1: *

## Nets that join several sheets
GND: Microcontroller (24 pins), Stepper drivers (9 pins), Heated bed (*#2.2 *#3.2 BED.2 C?#2.2), LCD Screen (U3.6 U3.7 U3.8 U3.40), Limit switches (9 pins), Relay controll extension board v1.5 (6 pins), Extruder (6 pins), Ethernet (18 pins), Outputs (10 pins)
VCC_3V3: Microcontroller (23 pins), Stepper drivers (6 pins), Heated bed (R39.2 R?#2.1), LCD Screen (U3.1 U3.2 U3.3 U3.36), Limit switches (6 pins)
VCC_5V: Microcontroller (UART.1 USB_DISC.1), LCD Screen (U3.4 U3.5), Limit switches (5 pins), Relay controll extension board v1.5 (5 pins)
VCC_24V: Stepper drivers (C99.1 U?#4.22 U?#4.28), Relay controll extension board v1.5 (JP35.7), Extruder (11 pins), Outputs (5 pins)
NetJP35_1: Microcontroller (U8.141), Relay controll extension board v1.5 (JP35.1)
NetQ?_1: Microcontroller (U8.110), Outputs (Q?.1 R?#19.2)
NetR2_1: Microcontroller (U8.5), Limit switches (R2.1)
NetR3#3_2: Microcontroller (U8.22), Outputs (R3#3.2 R5#2.2)
NetR4_2: Microcontroller (U8.50), Limit switches (R4.2)
NetR6#2_1: Microcontroller (U8.9), Limit switches (R6#2.1)
NetR8_2: Microcontroller (U8.8), Limit switches (R8.2)
NetR10_1: Microcontroller (U8.7), Limit switches (R10.1)
NetR16_1: Microcontroller (U8.142), Relay controll extension board v1.5 (R16.1)
NetR27_2: Microcontroller (U8.91), Outputs (R27.2 R31#1.2)
NetR31#2_2: Microcontroller (U8.124), Outputs (R31#2.2 R100.2)
NetR34_1: Microcontroller (U8.136), Extruder (R34.1 R50.2)
NetR39_1: Microcontroller (U8.48), Heated bed (R39.1 R40.1)
NetR43_1: Microcontroller (U8.28), Heated bed (R43.1)
NetR48_2: Microcontroller (U8.123), Extruder (R48.2 R49.1)
NetR?#6_1: Microcontroller (U8.2), Limit switches (R?#6.1)
NetU8_88: Microcontroller (U8.88), Heated bed (U13.6)
Thermocouple_+: Microcontroller (U?#3.3), Extruder (J?#7.39)
Thermocouple_-: Microcontroller (U?#3.2), Extruder (J?#7.40)